# EAGLE design Receiver (EAGLE 8.4.2)
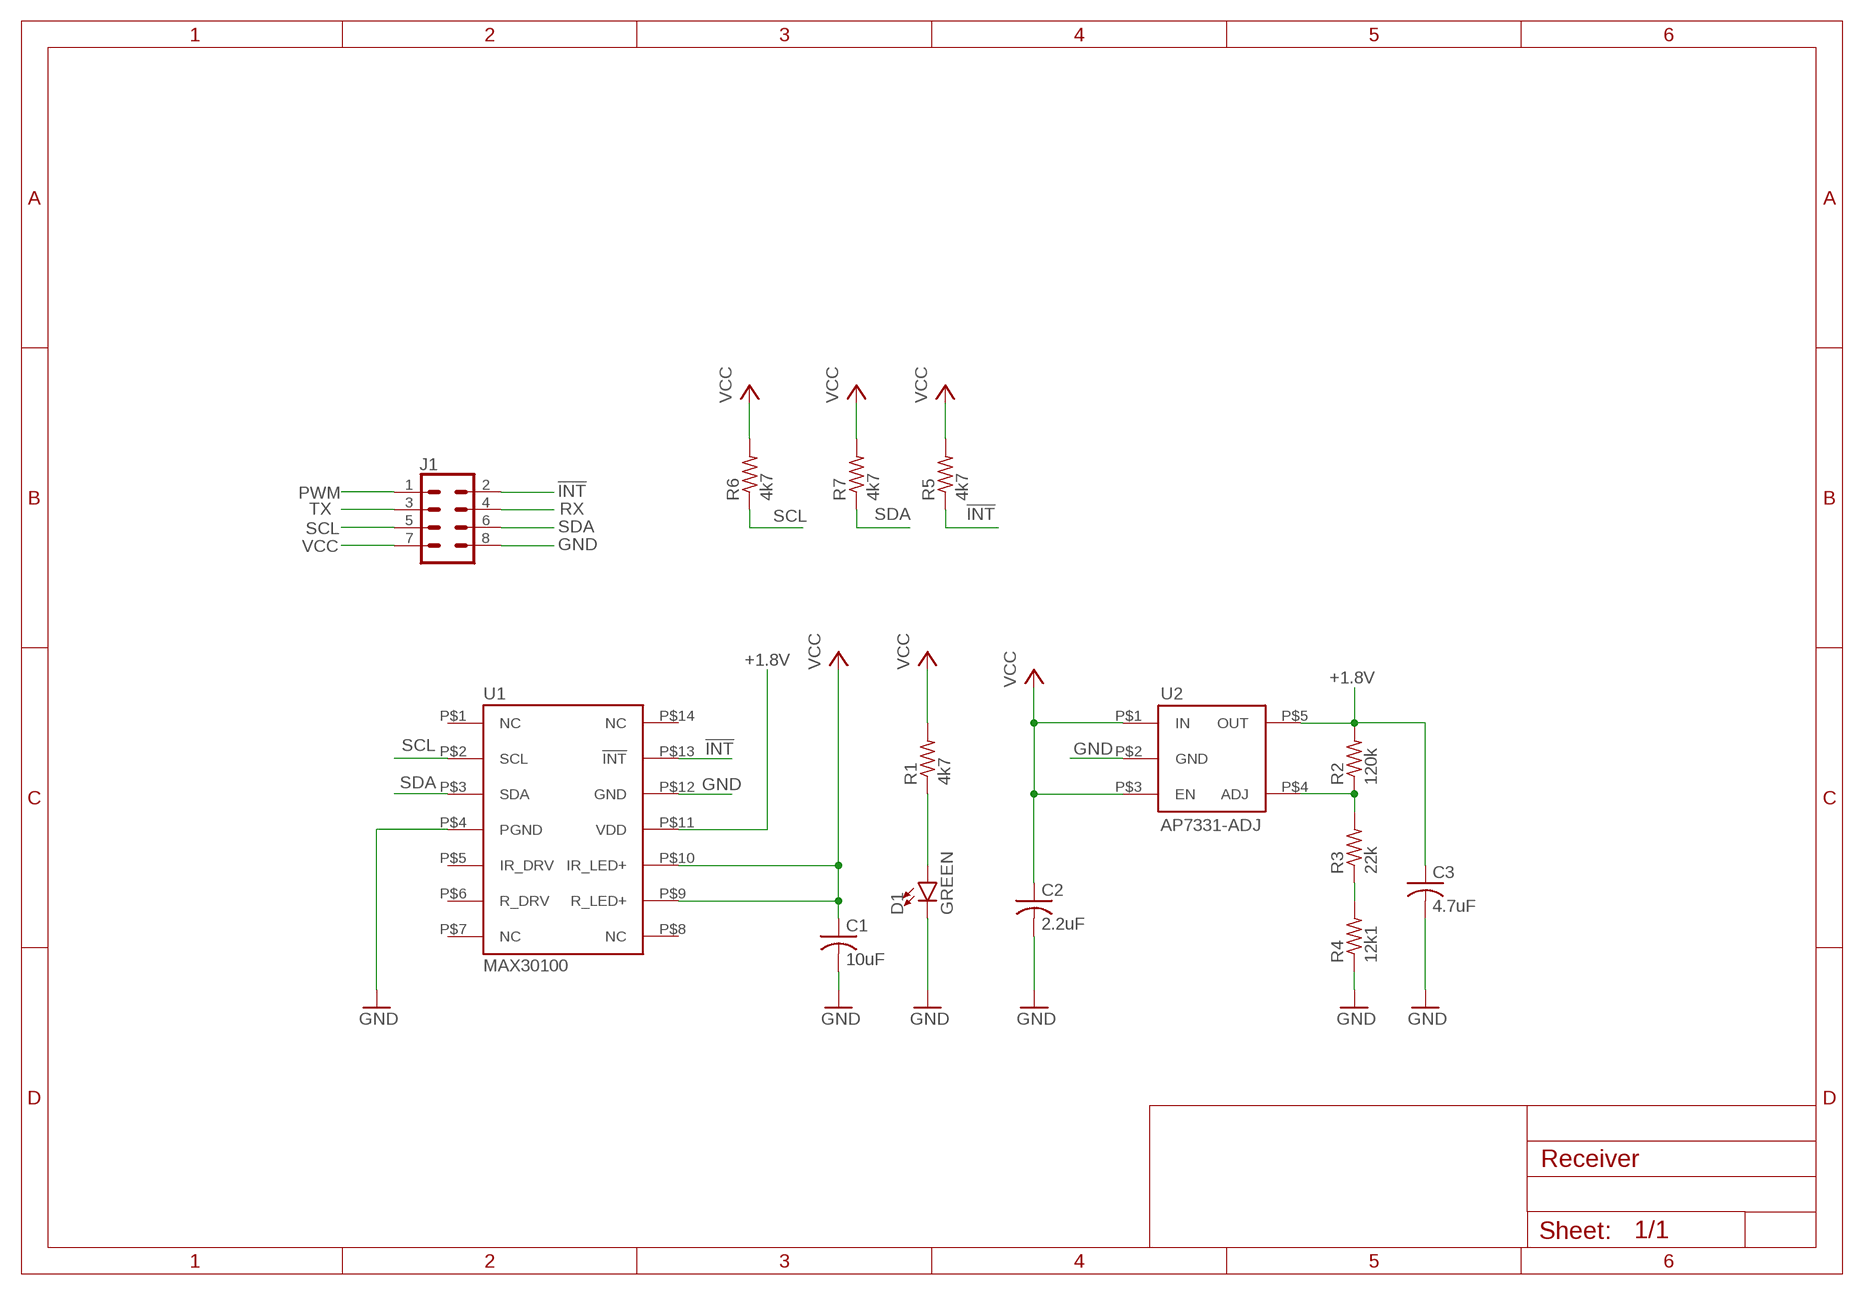
[diagram p0: schematic, sheet 1]

## Parts
C1  10uF  C-USC0805  [C0805]
C2  2.2uF  C-USC0805  [C0805]
C3  4.7uF  C-USC0805  [C0805]
D1  GREEN  LED-GREEN0603  [LED-0603]
J1  CONN_04X2  [2X4]
R1  4k7  R-US_R0805  [R0805]
R2  120k  R-US_R0805  [R0805]
R3  22k  R-US_R0805  [R0805]
R4  12k1  R-US_R0805  [R0805]
R5  4k7  R-US_R0805  [R0805]
R6  4k7  R-US_R0805  [R0805]
R7  4k7  R-US_R0805  [R0805]
U1  MAX30100  [14OESIP]
U2  AP7331-ADJ  [SOT25]

## Nets
!INT!: J1.2 R5.1 U1.P$13(!INT!)
+1.8V: C3.1 R2.2 U1.P$11(VDD) U2.P$5(OUT)
GND: C1.2 C2.2 C3.2 D1.C J1.8 R4.1 U1.P$4(PGND) U1.P$12(GND) U2.P$2(GND)
N$1: D1.A R1.1
N$2: R2.1 R3.2 U2.P$4(ADJ)
N$3: R3.1 R4.2
PWM: J1.1
RX: J1.4
SCL: J1.5 R6.1 U1.P$2(SCL)
SDA: J1.6 R7.1 U1.P$3(SDA)
TX: J1.3
VCC: C1.1 C2.1 J1.7 R1.2 R5.2 R6.2 R7.2 U1.P$9(R_LED+) U1.P$10(IR_LED+) U2.P$1(IN) U2.P$3(EN)
Unconnected: U1.P$1(NC) U1.P$5(IR_DRV) U1.P$6(R_DRV) U1.P$7(NC) U1.P$8(NC) U1.P$14(NC)

## Library data of the parts
C1-C3 = rcl:C-US: CAPACITOR, American symbol
D1 = SparkFun-LED:LED-GREEN: Green SMD LED Used in manufacturing of various products at SparkFun Packages: 0603 - SMD 0603 package [Product Link] <http://www.futureelectronics.com/en/technologies/semiconductors/optoelectronics/leds/Pages/9894312-LTST-C190GKT.aspx?CrossPart=HSMG-C190&IM=0> LilyPad 1206 - SMD1206 LilyPad package [Product Link] <http://www.futureelectronics.com/en/Technologies/Product.aspx?ProductID=IN150NGHARVATEKCORPORATION2049943&IM=0> 1206 - SMD1206 package [Product Link] <http://www.futureelectronics.com/en/technologies/semiconductors/optoelectronics/leds/Pages/8315665-LTST-C150KGKT.aspx?IM=0> 1206 Bottom Mount -SMD 1206 Bottom Mount [Product Link] <http://www.digikey.com/product-detail/en/lite-on-inc/LTST-C230KGKT/160-1456-1-ND/386854> SparkFun Products: Pro Mini 328 -5V <https://www.sparkfun.com/products/821> RedBoard <https://www.sparkfun.com/products/12757> MP3 Trigger <https://www.sparkfun.com/products/13720> Makey Makey <https://www.sparkfun.com/products/11076>; PROD_ID: DIO-00821
J1 = SparkFun-Connectors:CONN_04X2: Multi connection point. Often used as Generic Header-pin footprint for 0.1 inch spaced/style header connections On any of the 0.1 inch spaced packages, you can populate with these: Break Away Headers - Straight <https://www.sparkfun.com/products/116> (PRT-00116) Break Away Male Headers - Right Angle <https://www.sparkfun.com/products/553> (PRT-00553) Female Headers <https://www.sparkfun.com/products/115> (PRT-00115) Break Away Headers - Machine Pin <https://www.sparkfun.com/products/117> (PRT-00117) Break Away Female Headers - Swiss Machine Pin <https://www.sparkfun.com/products/743> (PRT-00743)
R1-R7 = rcl:R-US_: RESISTOR, American symbol
U1 = CustomLibrary:MAX30100: MAX30100
U2 = CustomLibrary:AP7331-ADJ: AP7331-ADJ

## Board
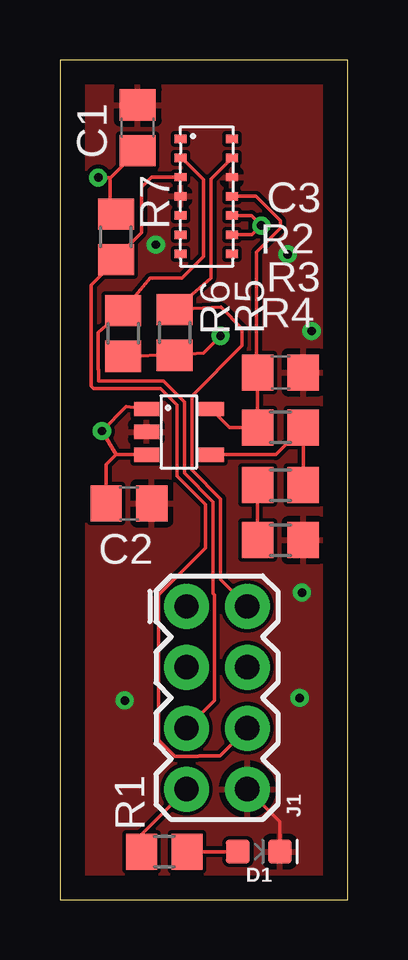
[diagram p1: board, top side]
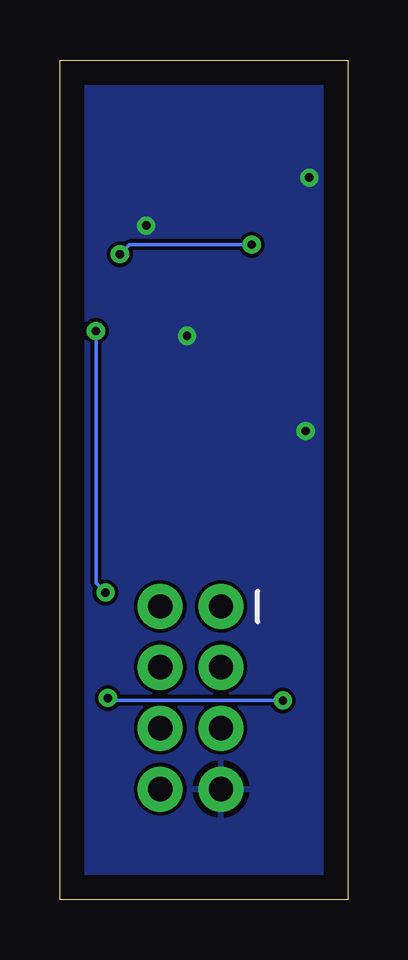
[diagram p2: board, bottom side, seen from below]

Size 12 x 35 mm. Coordinates in mm from the lower left corner, seen from the top.
Outline: 0,0 12,0 12,35 0,35 0,0
Copper layers (1*16): Top 0.035mm / dielectric 1.5mm / Bottom 0.035mm
Design rules "default": minimum track width 6mil, minimum drill 0.35mm, track to track 6mil, track to pad 6mil, pad to pad 6mil, via to via 6mil, smd to smd 6mil, copper to edge 40mil, drill to drill 6mil, minimum pad ring 10mil, minimum via ring 8mil, stop-mask expansion 4mil, vias tented up to drill 0mil, thermal gap 10mil

### Footprints (pad centres in the part's own frame; a part is rotated, then mirrored left to right if it is on the bottom)
C0805 = smd 1.3 x 1.5: 1 -0.95,0; 2 0.95,0
LED-0603 = smd 1 x 1: A -0.877,0; C 0.877,0
2X4 = drill 1.016 pad 1.88: 1 -3.81,-1.27; 2 -3.81,1.27; 3 -1.27,-1.27; 4 -1.27,1.27; 5 1.27,-1.27; 6 1.27,1.27; 7 3.81,-1.27; 8 3.81,1.27
R0805 = smd 1.3 x 1.5: 1 -0.95,0; 2 0.95,0
14OESIP = smd 0.5 x 0.35: P$1 0,0; P$2 0,-0.8; P$3 0,-1.6; P$4 0,-2.4; P$5 0,-3.2; P$6 0,-4; P$7 0,-4.8; P$8 2.15,-4.8; P$9 2.15,-4; P$10 2.15,-3.2; P$11 2.15,-2.4; P$12 2.15,-1.6; P$13 2.15,-0.8; P$14 2.15,0
SOT25 = smd 0.6 x 1.05: P$1 0,0; P$2 0.95,0; P$3 1.9,0; P$4 1.9,2.7; P$5 0,2.7

### Placement (x,y rotation side)
C1  3.24,32.17 90 top
C2  2.88,16.51 0 top
C3  9.2,21.97 0 top
D1  8.3,2 0 top
J1  6.55,8.41 270 top
R1  4.35,2 180 top
R2  9.2,19.68 180 top
R3  9.2,17.27 0 top
R4  9.2,14.98 180 top
R5  4.79,23.64 270 top
R6  2.65,23.6 270 top
R7  2.34,27.62 90 top
U1  5.03,31.71 0 top
U2  3.61,20.45 270 top

### Tracks (layer width: path | path; a pad name or v marks a point on that pad's centre or on a via)
!INT!
  Top 0.152: U1.P$13 6.3,30.03 6.3,25.9 R5.1 6.71,24.69 7.6,23.8 7.6,23.1 5.5,21 5.5,17.9 6.7,16.7 6.7,13.34 J1.2
+1.8V
  Top 0.152: U2.P$5 7.07,19.68 R2.2 C3.1 8.2,22.02 8.2,27 9.2,28 9.2,28.3 8.19,29.31 U1.P$11
GND  (via drill 0.35)
  Top 0.152: J1.8 9.18,3.24 D1.C
  Bottom 0.152: v4,27.3 9.1,27.3 v9.5,26.9 | v2.7,8.3 4.79,8.3 4.8,8.31 9.91,8.31 v10,8.4 | v10.1,12.8 10.5,13.2 v10.5,23.7
  pour Top: 0.4,34.6 0.2,0.2 11.9,0.2 11.8,0.3 12,34.6
N$1
  Top 0.152: D1.A R1.1
N$2
  Top 0.152: R3.2 R2.1 9.01,18.55 U2.P$4
N$3
  Top 0.152: R4.2 R3.1
SCL
  Top 0.152: U1.P$2 5.09,30.91 5.99,30.01 5.99,26.8 5.1,25.91 5.1,25.9 3.76,25.9 R6.1 | R6.1 2.54,24.51 | R6.1 1.6,23.64 1.6,22.1 1.6,22.09 1.6,21.61 4.33,21.61 5.2,20.74 5.2,17.77 6.39,16.57 6.39,12.76 6.45,12.7 6.45,8.31 J1.5
SDA
  Top 0.152: 6.07,14.81 6.07,16.47 4.89,17.65 4.89,20.61 4.2,21.3 1.4,21.3 1.3,21.4 1.3,21.97 1.29,21.97 1.29,22.2 1.29,22.21 1.29,25.62 R7.1 | 6.07,14.81 | 5.01,30.11 U1.P$3 3.81,30.11 3.4,29.7 3.4,27.8 2.34,26.74 R7.1 | 2.27,27.07 R7.1 | 6.07,14.81 6.07,14.66 4.11,12.7 4.11,6.66 4.8,5.97 5.76,5.97 5.79,6 6.68,6 J1.6
VCC  (via drill 0.35)
  Top 0.152: U2.P$1 2.77,20.55 v1.75,19.53 2.33,18.55 | U2.P$3 2.33,18.55 | C1.1 2.12,30.1 2.1,30.1 | v1.6,30.1 2.1,30.1 | R1.2 3.4,2.72 J1.7 | U1.P$10 7.99,28.51 v8.4,28.1 8.01,27.71 U1.P$9 | 2.33,18.55 1.93,18.14 C2.1 | R6.2 R5.2 5.99,22.79 v6.7,23.5 | 2.1,30.1 2.1,28.81 R7.2
  pour Bottom: 0.5,34.3 11.8,34.3 11.6,0.4 0.5,0.6